# EAGLE design flash_card_v01 (EAGLE 6.1)
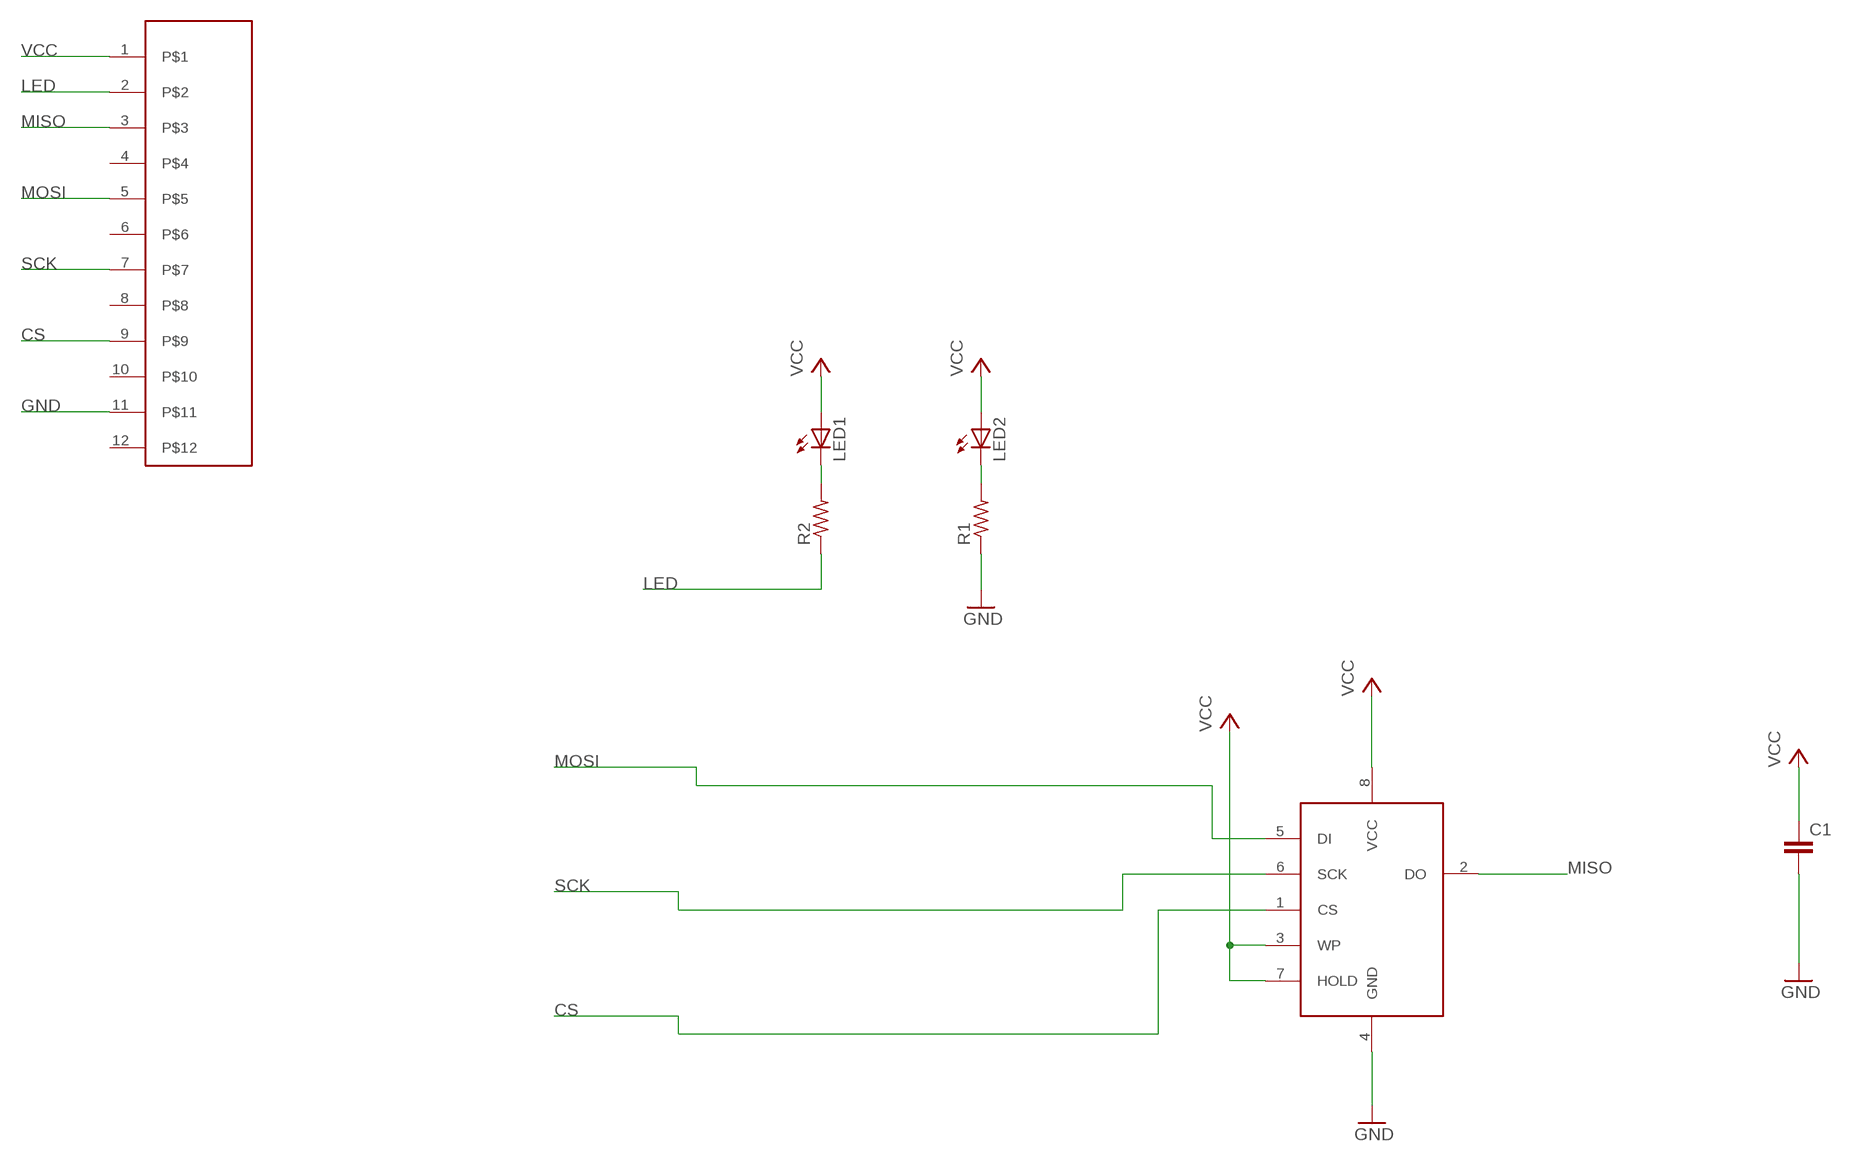
[diagram p0: schematic, sheet 1]

## Parts
C1  CAP0603  [C0603]
LED1  LED1206  [CHIPLED_1206]
LED2  LED1206  [CHIPLED_1206]
R1  RES0603  [R0603]
R2  RES0603  [R0603]
U$1  M25PXX  [SO08]
U$2  SAMCARD6  [SAMCARD6]

## Nets
CS: U$1.1(CS) U$2.9
GND [power]: C1.2 R1.1 U$1.4(GND) U$2.11
LED: R2.1 U$2.2
MISO: U$1.2(DO) U$2.3
MOSI: U$1.5(DI) U$2.5
N$1: LED1.C R2.2
N$2: LED2.C R1.2
SCK: U$1.6(SCK) U$2.7
VCC [power]: C1.1 LED1.A LED2.A U$1.3(WP) U$1.7(HOLD) U$1.8(VCC) U$2.1
Unconnected: U$2.4 U$2.6 U$2.8 U$2.10 U$2.12

## Library data of the parts
C1 = SparkFun:CAP: CAPACITOR
LED1 LED2 = SparkFun:LED
R1 R2 = SparkFun:RES: RESISTOR
U$1 = sfe_owen:M25PXX
U$2 = sfe_owen:SAMCARD6

## Net classes
0 default: width 0.305 mm
1 power: width 0.305 mm

## Board
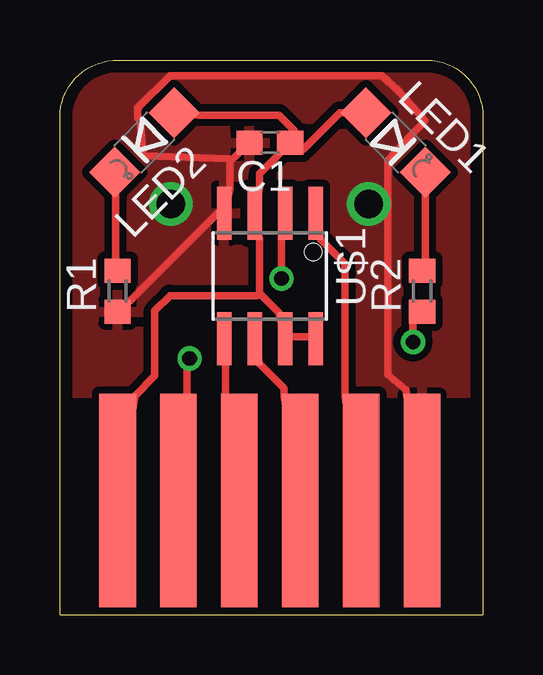
[diagram p1: board, top side]
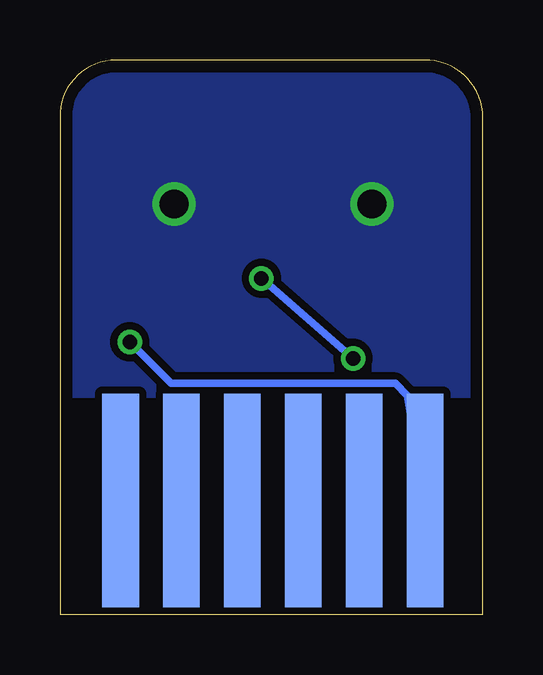
[diagram p2: board, bottom side, seen from below]

Size 17.64 x 23.12 mm. Coordinates in mm from the lower left corner, seen from the top.
Outline: 0,0 17.64,0 17.64,20.95 arc90 15.1,23.11 2.67,23.11 arc90 0,20.95 0,0
Copper layers (1*16): Top 0.035mm / dielectric 1.5mm / Bottom 0.035mm
Design rules: minimum track width 12mil, minimum drill 24mil, track to track 10mil, track to pad 10mil, pad to pad 10mil, via to via 10mil, smd to smd 10mil, copper to edge 20mil, drill to drill 8mil, minimum pad ring 10mil, minimum via ring 8mil, stop-mask expansion 4mil, vias tented up to drill 0mil, thermal gap 10mil

### Footprints (pad centres in the part's own frame; a part is rotated, then mirrored left to right if it is on the bottom)
C0603 = smd 1.1 x 1: 1 -0.85,0; 2 0.85,0
CHIPLED_1206 = smd 1.5 x 1.5: A 0,-1.75; C 0,1.75
R0603 = smd 1 x 1.1: 1 -0.85,0; 2 0.85,0
SO08 = smd 0.61 x 2.21: 1 -1.905,-2.616; 2 -0.635,-2.616; 3 0.635,-2.616; 4 1.905,-2.616; 5 1.905,2.616; 6 0.635,2.616; 7 -0.635,2.616; 8 -1.905,2.616
SAMCARD6 = smd 1.524 x 8.89: 1 -6.35,-0.635; 3 -3.81,-0.635; 5 -1.27,-0.635; 7 1.27,-0.635; 9 3.81,-0.635; 11 6.35,-0.635 | smd 1.524 x 8.89 bottom: 2 -6.35,-0.635; 4 -3.81,-0.635; 6 -1.27,-0.635; 8 1.27,-0.635; 10 3.81,-0.635; 12 6.35,-0.635

### Placement (x,y rotation side)
C1  8.76,19.68 180 top
LED1  13.99,19.69 225 top
LED2  3.52,19.68 135 top
R1  2.41,13.49 90 top
R2  15.11,13.49 90 top
U$1  8.76,14.13 180 top
U$2  8.76,5.4 0 top

### Tracks (layer width: path | path; a pad name or v marks a point on that pad's centre or on a via)
CS
  Top 0.305: U$1.1 10.86,15.65 11.88,14.63 11.88,9.14 U$2.9
GND  (via drill 1.2)
  Top 0.305: R1.1 2.94,13.11 6.6,16.76 U$1.4 7.1,17.78 7.1,18.9 | 7.1,18.9 7.41,19.2 C1.2 | 7.1,18.9 7,19 3.47,19.12 3.35,20.62 3.24,20.73 3.24,21.13 4.59,22.48 13.42,22.48 14.09,21.86 15.22,20.6 13.69,18.94 13.69,10 14.42,9.39 U$2.11
  other vias: 4.62,17.12 12.88,17.12
  pour Bottom (isolate 0.305): 0.25,9.75 0.25,21.48 arc-90 1.52,22.75 15.62,22.75 15.98,22.75 arc-90 17.25,21.48 17.25,9.25 0.62,9.25 arc-90 0.25,9.62
  pour Top (isolate 0.305): 0.25,9.25 17.38,9.25 17.38,20.88 arc90 15.38,22.88 2.62,22.88 arc90 0.25,20.5
LED  (via drill 0.61)
  Top 0.305: v14.72,11.38 14.72,12.19 R2.1
  Bottom 0.305: v14.72,11.38 13,9.65 3.65,9.65 3.14,9.14 U$2.2
MISO  (via drill 0.61)
  Top 0.305: v9.24,14.02 9.24,15.65 U$1.2 | v5.41,10.69 5.31,10.59 5.31,9.14 U$2.3
  Bottom 0.305: v5.41,10.69 v9.24,14.02
MOSI
  Top 0.305: U$1.5 6.9,10.46 6.9,9.14 U$2.5
N$1
  Top 0.305: R2.2 15.23,14.83 15.23,17.37 LED1.C
N$2
  Top 0.305: R1.2 2.33,14.83 2.33,17.37 LED2.C
SCK
  Top 0.305: U$1.6 8.32,10.46 9.34,9.45 9.34,9.14 U$2.7
VCC
  Top 0.305: U$1.8 10.46,11.58 9.64,11.58 U$1.7 9.14,12.6 8.32,13.41 | C1.1 9.14,19.2 8.32,18.39 8.32,17.78 U$1.3 8.32,15.65 8.32,13.41 | LED2.A 5.78,20.83 9.13,20.83 9.76,20.19 9.76,20.12 C1.1 | LED1.A 11.68,20.93 10.15,19.41 C1.1 | 8.32,13.41 8.22,13.31 4.59,13.31 3.95,12.68 3.95,9.96 3.14,9.14 U$2.1